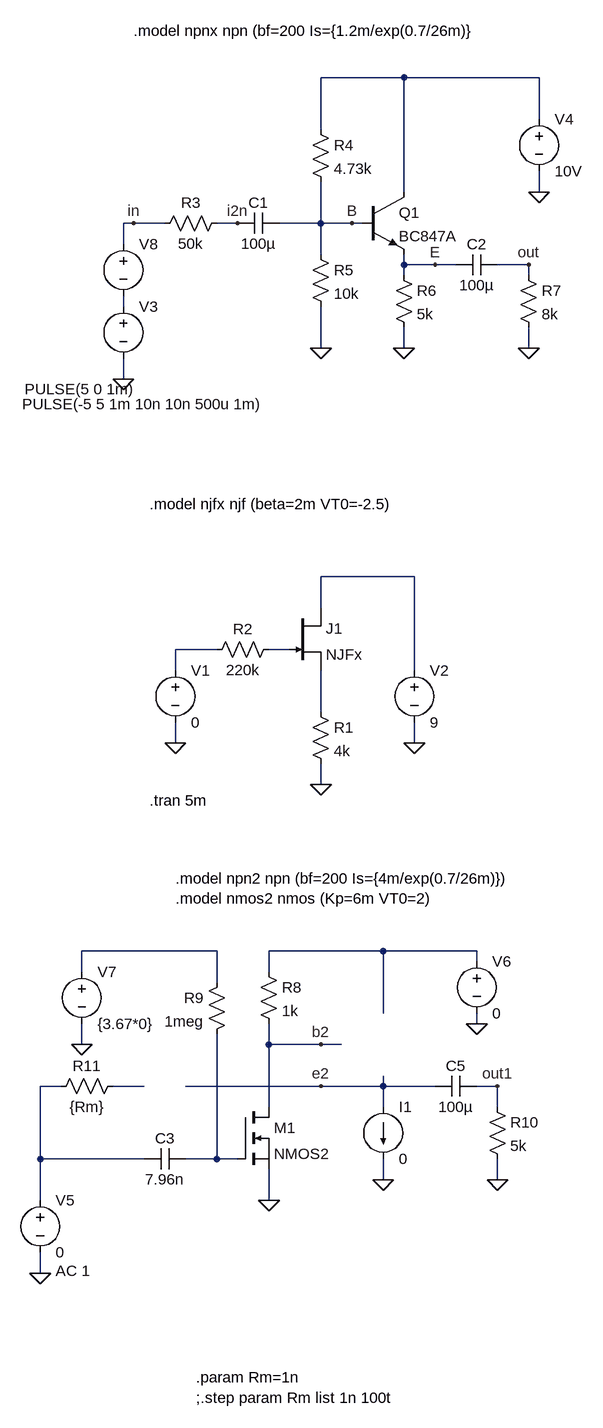
[diagram p0: schematic ss07.asc]
ss07.asc, the LTspice schematic file:
Version 4
SHEET 1 880 1444
WIRE 368 -768 240 -768
WIRE 576 -768 368 -768
WIRE 576 -704 576 -768
WIRE 240 -688 240 -768
WIRE 368 -592 368 -768
WIRE 576 -592 576 -624
WIRE -48 -544 -64 -544
WIRE 0 -544 -48 -544
WIRE 112 -544 80 -544
WIRE 240 -544 240 -608
WIRE 240 -544 176 -544
WIRE 288 -544 240 -544
WIRE 304 -544 288 -544
WIRE -64 -512 -64 -544
WIRE 240 -496 240 -544
WIRE 368 -480 368 -496
WIRE 416 -480 368 -480
WIRE 448 -480 416 -480
WIRE 560 -480 512 -480
WIRE 368 -464 368 -480
WIRE 560 -464 560 -480
WIRE -64 -416 -64 -432
WIRE 240 -352 240 -416
WIRE 368 -352 368 -384
WIRE 560 -352 560 -384
WIRE -64 -304 -64 -336
WIRE 384 0 240 0
WIRE 240 48 240 0
WIRE 80 112 16 112
WIRE 192 112 160 112
WIRE 16 144 16 112
WIRE 384 144 384 0
WIRE 240 208 240 144
WIRE 16 256 16 224
WIRE 384 256 384 224
WIRE 240 320 240 288
WIRE 80 576 -128 576
WIRE 336 576 160 576
WIRE 480 576 336 576
WIRE 480 592 480 576
WIRE -128 608 -128 576
WIRE 160 608 160 576
WIRE 80 624 80 576
WIRE 336 672 336 576
WIRE 480 688 480 672
WIRE -128 720 -128 688
WIRE 160 720 160 688
WIRE 240 720 160 720
WIRE 272 720 240 720
WIRE -160 784 -192 784
WIRE -32 784 -80 784
WIRE 240 784 32 784
WIRE 336 784 336 768
WIRE 336 784 240 784
WIRE 416 784 336 784
WIRE 512 784 480 784
WIRE 160 816 160 720
WIRE 336 816 336 784
WIRE 512 816 512 784
WIRE -192 896 -192 784
WIRE -32 896 -192 896
WIRE 80 896 80 704
WIRE 80 896 32 896
WIRE 112 896 80 896
WIRE 336 928 336 896
WIRE 512 928 512 896
WIRE -192 960 -192 896
WIRE 160 960 160 912
WIRE -192 1072 -192 1040
FLAG 16 256 0
FLAG 384 256 0
FLAG 240 320 0
FLAG -64 -304 0
FLAG 576 -592 0
FLAG 560 -352 0
FLAG 368 -352 0
FLAG 240 -352 0
FLAG 336 928 0
FLAG 160 960 0
FLAG -192 1072 0
FLAG 480 688 0
FLAG -128 720 0
FLAG 240 720 b2
FLAG 240 784 e2
FLAG 512 928 0
FLAG 512 784 out1
FLAG -48 -544 in
FLAG 288 -544 B
FLAG 416 -480 E
FLAG 560 -480 out
FLAG 112 -544 i2n
SYMBOL voltage 16 128 R0
WINDOW 123 0 0 Left 2
WINDOW 39 0 0 Left 2
SYMATTR InstName V1
SYMATTR Value 0
SYMBOL voltage 384 128 R0
SYMATTR InstName V2
SYMATTR Value 9
SYMBOL res 224 192 R0
SYMATTR InstName R1
SYMATTR Value 4k
SYMBOL njf 192 48 R0
SYMATTR InstName J1
SYMATTR Value NJFx
SYMBOL res 64 128 R270
WINDOW 0 32 56 VTop 2
WINDOW 3 0 56 VBottom 2
SYMATTR InstName R2
SYMATTR Value 220k
SYMBOL voltage -64 -432 R0
WINDOW 123 0 0 Left 2
WINDOW 39 0 0 Left 2
WINDOW 3 -156 166 Left 2
SYMATTR InstName V3
SYMATTR Value PULSE(-5 5 1m 10n 10n 500u 1m)
SYMBOL res 96 -560 R90
WINDOW 0 0 56 VBottom 2
WINDOW 3 32 56 VTop 2
SYMATTR InstName R3
SYMATTR Value 50k
SYMBOL cap 176 -560 R90
WINDOW 0 0 32 VBottom 2
WINDOW 3 32 32 VTop 2
SYMATTR InstName C1
SYMATTR Value 100µ
SYMBOL npn 304 -592 R0
SYMATTR InstName Q1
SYMATTR Value BC847A
SYMBOL res 224 -704 R0
SYMATTR InstName R4
SYMATTR Value 4.73k
SYMBOL res 224 -512 R0
SYMATTR InstName R5
SYMATTR Value 10k
SYMBOL res 352 -480 R0
SYMATTR InstName R6
SYMATTR Value 5k
SYMBOL res 544 -480 R0
SYMATTR InstName R7
SYMATTR Value 8k
SYMBOL cap 512 -496 R90
WINDOW 0 0 32 VBottom 2
WINDOW 3 32 32 VTop 2
SYMATTR InstName C2
SYMATTR Value 100µ
SYMBOL voltage 576 -720 R0
WINDOW 123 0 0 Left 2
WINDOW 39 0 0 Left 2
SYMATTR InstName V4
SYMATTR Value 10V
SYMBOL voltage -192 944 R0
WINDOW 123 24 124 Left 2
WINDOW 39 0 0 Left 2
SYMATTR Value2 AC 1
SYMATTR InstName V5
SYMATTR Value 0
SYMBOL cap 32 880 R90
WINDOW 0 0 32 VBottom 2
WINDOW 3 32 32 VTop 2
SYMATTR InstName C3
SYMATTR Value 7.96n
SYMBOL nmos 112 816 R0
SYMATTR InstName M1
SYMATTR Value NMOS2
SYMBOL current 336 816 R0
WINDOW 123 0 0 Left 2
WINDOW 39 0 0 Left 2
SYMATTR InstName I1
SYMATTR Value 0
SYMBOL res 144 592 R0
SYMATTR InstName R8
SYMATTR Value 1k
SYMBOL voltage 480 576 R0
WINDOW 123 0 0 Left 2
WINDOW 39 0 0 Left 2
SYMATTR InstName V6
SYMATTR Value 0
SYMBOL res 96 608 M0
SYMATTR InstName R9
SYMATTR Value 1meg
SYMBOL voltage -128 592 R0
WINDOW 123 0 0 Left 2
WINDOW 39 0 0 Left 2
SYMATTR InstName V7
SYMATTR Value {3.67*0}
SYMBOL cap 480 768 R90
WINDOW 0 0 32 VBottom 2
WINDOW 3 32 32 VTop 2
SYMATTR InstName C5
SYMATTR Value 100µ
SYMBOL res 496 800 R0
SYMATTR InstName R10
SYMATTR Value 5k
SYMBOL res -64 768 R90
WINDOW 0 0 56 VBottom 2
WINDOW 3 32 56 VTop 2
SYMATTR InstName R11
SYMATTR Value {Rm}
SYMBOL voltage -64 -528 R0
WINDOW 123 0 0 Left 2
WINDOW 39 24 44 Left 2
WINDOW 3 -152 239 Left 2
SYMATTR InstName V8
SYMATTR Value PULSE(5 0 1m)
TEXT -24 -112 Left 2 !.model njfx njf (beta=2m VT0=-2.5)
TEXT -24 344 Left 2 !.tran 5m
TEXT -48 -840 Left 2 !.model npnx npn (bf=200 Is={1.2m/exp(0.7/26m)}
TEXT 16 464 Left 2 !.model npn2 npn (bf=200 Is={4m/exp(0.7/26m)})\n.model nmos2 nmos (Kp=6m VT0=2)
TEXT 48 1232 Left 2 !.param Rm=1n\n;.step param Rm list 1n 100t

The netlist it stands for:
* ss07.asc
V1 N004 0 0
V2 N003 0 9
R1 N006 0 4k
J1 N003 N005 N006 NJFx
R2 N004 N005 220k
V3 N002 0 PULSE(-5 5 1m 10n 10n 500u 1m)
R3 i2n in 50k
C1 B i2n 100µ
Q1 N001 B E 0 BC847A
R4 N001 B 4.73k
R5 B 0 10k
R6 E 0 5k
R7 out 0 8k
C2 out E 100µ
V4 N001 0 10V
V5 N009 0 0 AC 1
C3 N011 N009 7.96n
M1 b2 N011 0 0 NMOS2
I1 e2 0 0
R8 N008 b2 1k
V6 N008 0 0
R9 N007 N011 1meg
V7 N007 0 {3.67*0}
C5 out1 e2 100µ
R10 out1 0 5k
R11 N010 N009 {Rm}
V8 in N002 PULSE(5 0 1m)
.model NPN NPN
.model PNP PNP
.lib standard.bjt
.model NJF NJF
.model PJF PJF
.lib standard.jft
.model NMOS NMOS
.model PMOS PMOS
.lib standard.mos
.model njfx njf (beta=2m VT0=-2.5)
.tran 5m
.model npnx npn (bf=200 Is={1.2m/exp(0.7/26m)}
.model npn2 npn (bf=200 Is={4m/exp(0.7/26m)})
.model nmos2 nmos (Kp=6m VT0=2)
.param Rm=1n
;.step param Rm list 1n 100t
.backanno
.end